# EAGLE design Display_02 (EAGLE 5.07)
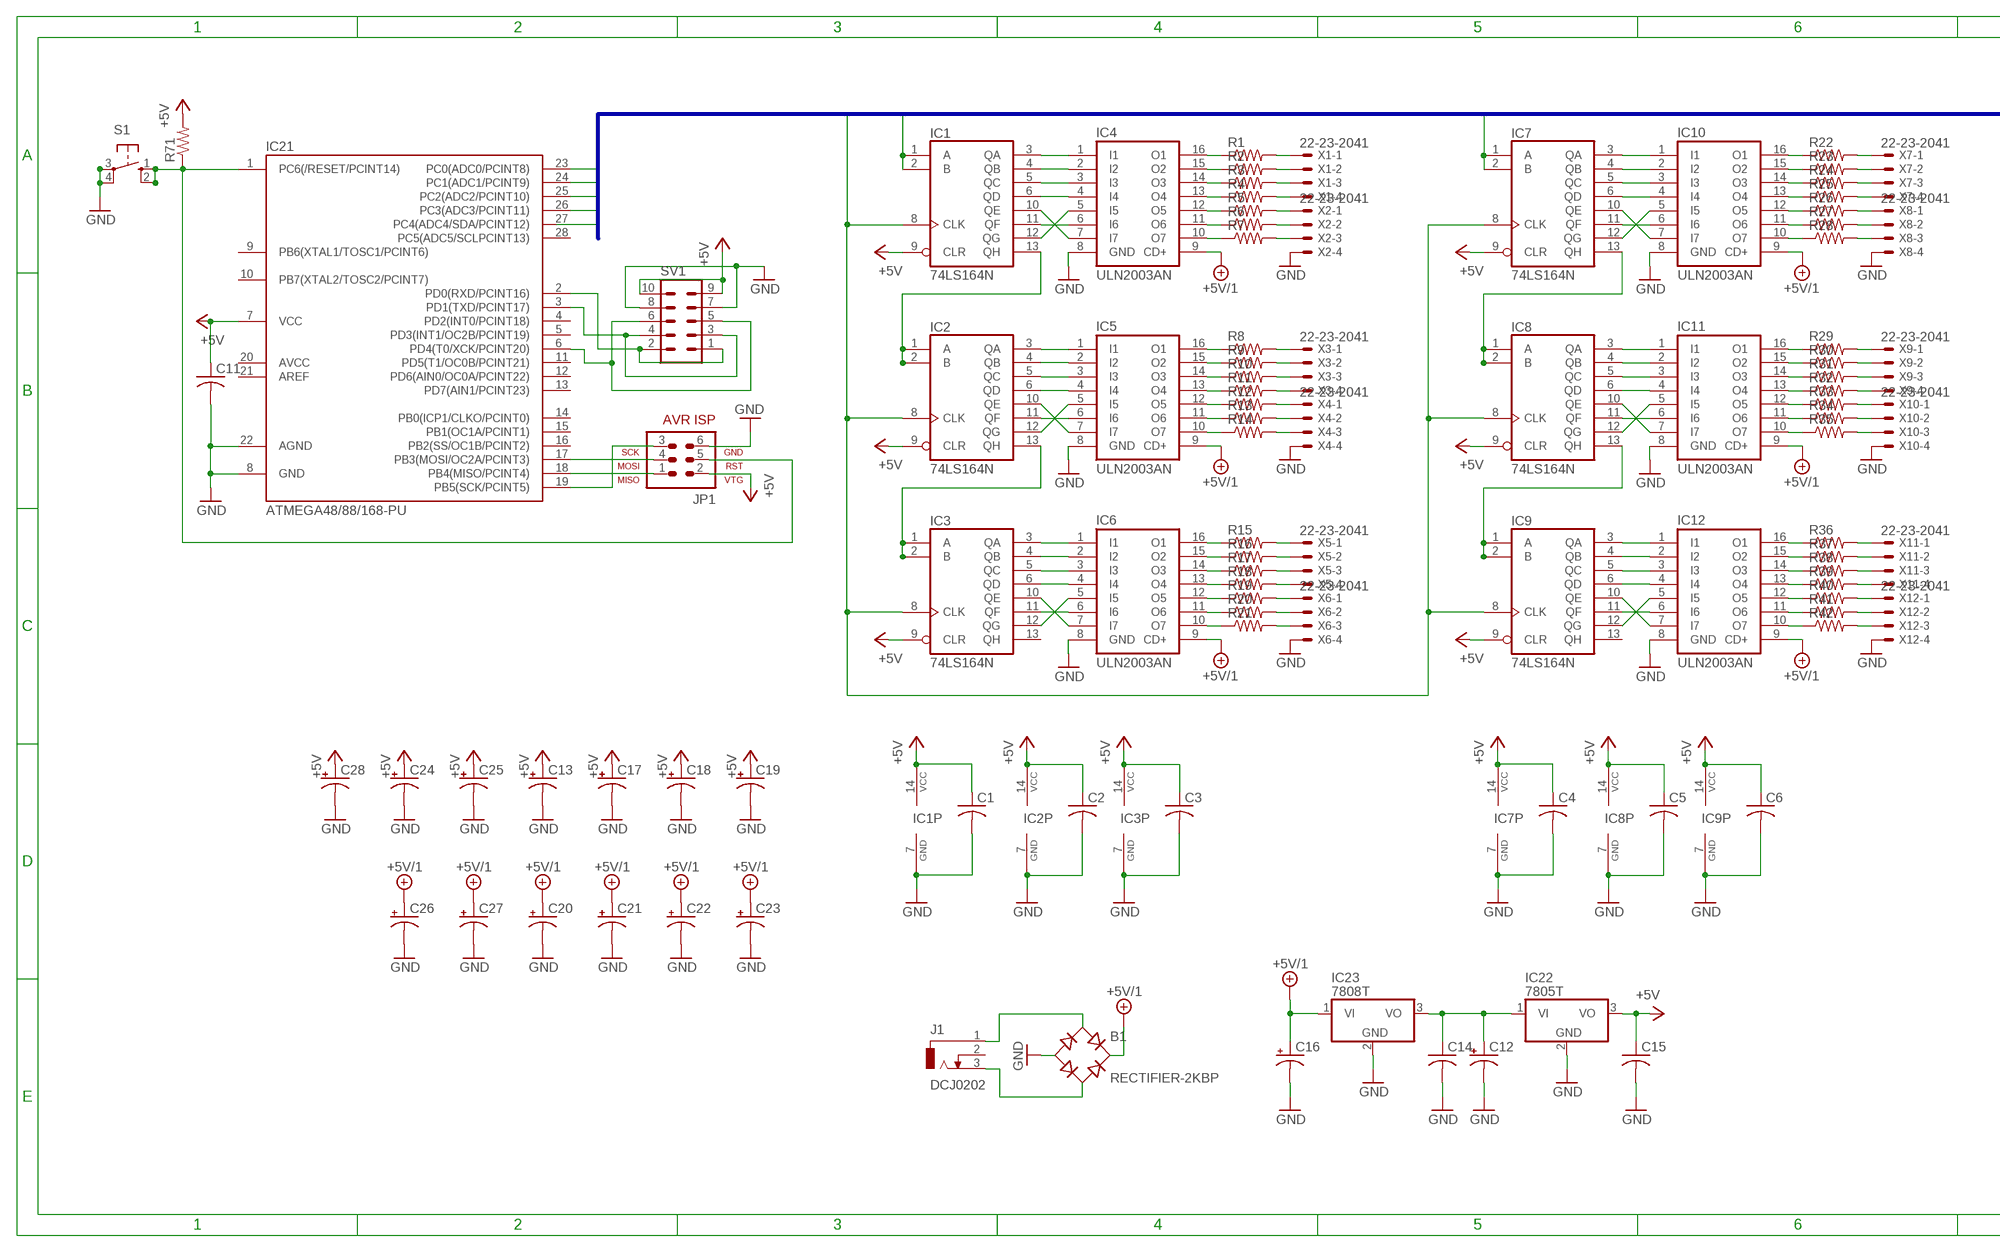
[diagram p0: schematic, sheet 1, part 1 of 2]
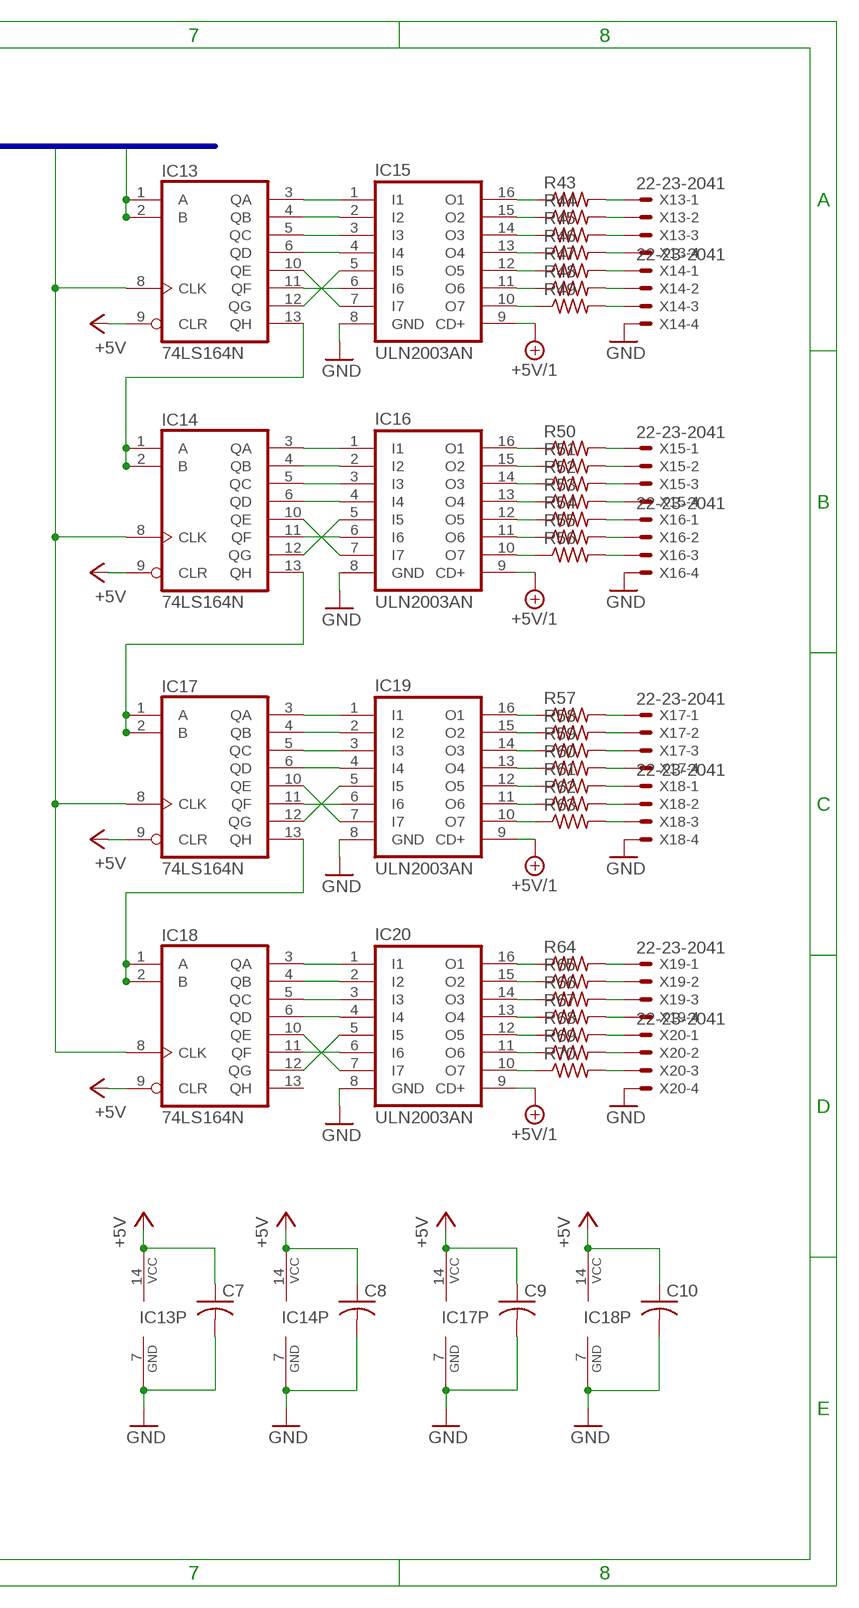
[diagram p1: schematic, sheet 1, part 2 of 2]

## Parts
B1  RECTIFIER-2KBP  [2KBP]
C1  C-US025-024X044  [C025-024X044]
C2  C-US025-024X044  [C025-024X044]
C3  C-US025-024X044  [C025-024X044]
C4  C-US025-024X044  [C025-024X044]
C5  C-US025-024X044  [C025-024X044]
C6  C-US025-024X044  [C025-024X044]
C7  C-US025-024X044  [C025-024X044]
C8  C-US025-024X044  [C025-024X044]
C9  C-US025-024X044  [C025-024X044]
C10  C-US025-024X044  [C025-024X044]
C11  C-US025-025X050  [C025-025X050]
C12  CPOL-USE2.5-7  [E2,5-7]
C13  CPOL-USE2.5-7  [E2,5-7]
C14  C-US025-030X050  [C025-030X050]
C15  C-US025-030X050  [C025-030X050]
C16  CPOL-USE2.5-7  [E2,5-7]
C17  CPOL-USE2.5-7  [E2,5-7]
C18  CPOL-USE2.5-7  [E2,5-7]
C19  CPOL-USE2.5-7  [E2,5-7]
C20  CPOL-USE2.5-7  [E2,5-7]
C21  CPOL-USE2.5-7  [E2,5-7]
C22  CPOL-USE2.5-7  [E2,5-7]
C23  CPOL-USE2.5-7  [E2,5-7]
C24  CPOL-USE2.5-7  [E2,5-7]
C25  CPOL-USE2.5-7  [E2,5-7]
C26  CPOL-USE2.5-7  [E2,5-7]
C27  CPOL-USE2.5-7  [E2,5-7]
C28  CPOL-USE2.5-7  [E2,5-7]
IC1  74LS164N  [DIL14]
IC2  74LS164N  [DIL14]
IC3  74LS164N  [DIL14]
IC4  ULN2003AN  [DIL16]
IC5  ULN2003AN  [DIL16]
IC6  ULN2003AN  [DIL16]
IC7  74LS164N  [DIL14]
IC8  74LS164N  [DIL14]
IC9  74LS164N  [DIL14]
IC10  ULN2003AN  [DIL16]
IC11  ULN2003AN  [DIL16]
IC12  ULN2003AN  [DIL16]
IC13  74LS164N  [DIL14]
IC14  74LS164N  [DIL14]
IC15  ULN2003AN  [DIL16]
IC16  ULN2003AN  [DIL16]
IC17  74LS164N  [DIL14]
IC18  74LS164N  [DIL14]
IC19  ULN2003AN  [DIL16]
IC20  ULN2003AN  [DIL16]
IC21  ATMEGA48/88/168-PU  [DIL28-3]
IC22  7805T  [TO220H]
IC23  7808T  [TO220H]
J1  DCJ0202  [DCJ0202]
JP1  AVR-ISP-6  [AVR-ISP-6]
R1  R-US_0204/7  [0204/7]
R2  R-US_0204/7  [0204/7]
R3  R-US_0204/7  [0204/7]
R4  R-US_0204/7  [0204/7]
R5  R-US_0204/7  [0204/7]
R6  R-US_0204/7  [0204/7]
R7  R-US_0204/7  [0204/7]
R8  R-US_0204/7  [0204/7]
R9  R-US_0204/7  [0204/7]
R10  R-US_0204/7  [0204/7]
R11  R-US_0204/7  [0204/7]
R12  R-US_0204/7  [0204/7]
R13  R-US_0204/7  [0204/7]
R14  R-US_0204/7  [0204/7]
R15  R-US_0204/7  [0204/7]
R16  R-US_0204/7  [0204/7]
R17  R-US_0204/7  [0204/7]
R18  R-US_0204/7  [0204/7]
R19  R-US_0204/7  [0204/7]
R20  R-US_0204/7  [0204/7]
R21  R-US_0204/7  [0204/7]
R22  R-US_0204/7  [0204/7]
R23  R-US_0204/7  [0204/7]
R24  R-US_0204/7  [0204/7]
R25  R-US_0204/7  [0204/7]
R26  R-US_0204/7  [0204/7]
R27  R-US_0204/7  [0204/7]
R28  R-US_0204/7  [0204/7]
R29  R-US_0204/7  [0204/7]
R30  R-US_0204/7  [0204/7]
R31  R-US_0204/7  [0204/7]
R32  R-US_0204/7  [0204/7]
R33  R-US_0204/7  [0204/7]
R34  R-US_0204/7  [0204/7]
R35  R-US_0204/7  [0204/7]
R36  R-US_0204/7  [0204/7]
R37  R-US_0204/7  [0204/7]
R38  R-US_0204/7  [0204/7]
R39  R-US_0204/7  [0204/7]
R40  R-US_0204/7  [0204/7]
R41  R-US_0204/7  [0204/7]
R42  R-US_0204/7  [0204/7]
R43  R-US_0204/7  [0204/7]
R44  R-US_0204/7  [0204/7]
R45  R-US_0204/7  [0204/7]
R46  R-US_0204/7  [0204/7]
R47  R-US_0204/7  [0204/7]
R48  R-US_0204/7  [0204/7]
R49  R-US_0204/7  [0204/7]
R50  R-US_0204/7  [0204/7]
R51  R-US_0204/7  [0204/7]
R52  R-US_0204/7  [0204/7]
R53  R-US_0204/7  [0204/7]
R54  R-US_0204/7  [0204/7]
R55  R-US_0204/7  [0204/7]
R56  R-US_0204/7  [0204/7]
R57  R-US_0204/7  [0204/7]
R58  R-US_0204/7  [0204/7]
R59  R-US_0204/7  [0204/7]
R60  R-US_0204/7  [0204/7]
R61  R-US_0204/7  [0204/7]
R62  R-US_0204/7  [0204/7]
R63  R-US_0204/7  [0204/7]
R64  R-US_0204/7  [0204/7]
R65  R-US_0204/7  [0204/7]
R66  R-US_0204/7  [0204/7]
R67  R-US_0204/7  [0204/7]
R68  R-US_0204/7  [0204/7]
R69  R-US_0204/7  [0204/7]
R70  R-US_0204/7  [0204/7]
R71  R-US_0204/7  [0204/7]
S1  10-XX  [B3F-10XX]
SV1  MA05-2  [MA05-2]
X1  22-23-2041  [22-23-2041]
X2  22-23-2041  [22-23-2041]
X3  22-23-2041  [22-23-2041]
X4  22-23-2041  [22-23-2041]
X5  22-23-2041  [22-23-2041]
X6  22-23-2041  [22-23-2041]
X7  22-23-2041  [22-23-2041]
X8  22-23-2041  [22-23-2041]
X9  22-23-2041  [22-23-2041]
X10  22-23-2041  [22-23-2041]
X11  22-23-2041  [22-23-2041]
X12  22-23-2041  [22-23-2041]
X13  22-23-2041  [22-23-2041]
X14  22-23-2041  [22-23-2041]
X15  22-23-2041  [22-23-2041]
X16  22-23-2041  [22-23-2041]
X17  22-23-2041  [22-23-2041]
X18  22-23-2041  [22-23-2041]
X19  22-23-2041  [22-23-2041]
X20  22-23-2041  [22-23-2041]

## Nets
+5V: C1.1 C2.1 C3.1 C4.1 C5.1 C6.1 C7.1 C8.1 C9.1 C10.1 C11.1 C13.+ C15.1 C17.+ C18.+ C19.+ C24.+ C25.+ C28.+ IC1.9(CLR) IC1.14(VCC) IC2.9(CLR) IC2.14(VCC) IC3.9(CLR) IC3.14(VCC) IC7.9(CLR) IC7.14(VCC) IC8.9(CLR) IC8.14(VCC) IC9.9(CLR) IC9.14(VCC) IC13.9(CLR) IC13.14(VCC) IC14.9(CLR) IC14.14(VCC) IC17.9(CLR) IC17.14(VCC) IC18.9(CLR) IC18.14(VCC) IC21.7(VCC) IC22.3(VO) JP1.2 R71.2 SV1.9 SV1.10
+5V/1: B1.+ C16.+ C20.+ C21.+ C22.+ C23.+ C26.+ C27.+ IC4.9(CD+) IC5.9(CD+) IC6.9(CD+) IC10.9(CD+) IC11.9(CD+) IC12.9(CD+) IC15.9(CD+) IC16.9(CD+) IC19.9(CD+) IC20.9(CD+) IC23.1(VI)
GND: B1.- C1.2 C2.2 C3.2 C4.2 C5.2 C6.2 C7.2 C8.2 C9.2 C10.2 C11.2 C12.- C13.- C14.2 C15.2 C16.- C17.- C18.- C19.- C20.- C21.- C22.- C23.- C24.- C25.- C26.- C27.- C28.- IC1.7(GND) IC2.7(GND) IC3.7(GND) IC4.8(GND) IC5.8(GND) IC6.8(GND) IC7.7(GND) IC8.7(GND) IC9.7(GND) IC10.8(GND) IC11.8(GND) IC12.8(GND) IC13.7(GND) IC14.7(GND) IC15.8(GND) IC16.8(GND) IC17.7(GND) IC18.7(GND) IC19.8(GND) IC20.8(GND) IC21.8(GND) IC21.22(AGND) IC22.2(GND) IC23.2(GND) JP1.6 S1.3(P) S1.4(P1) SV1.7 SV1.8 X2.4 X4.4 X6.4 X8.4 X10.4 X12.4 X14.4 X16.4 X18.4 X20.4
N$1: IC1.3(QA) IC4.1(I1)
N$2: IC1.4(QB) IC4.2(I2)
N$3: IC1.5(QC) IC4.3(I3)
N$4: IC1.6(QD) IC4.4(I4)
N$5: IC1.10(QE) IC4.7(I7)
N$6: IC1.11(QF) IC4.6(I6)
N$7: IC1.12(QG) IC4.5(I5)
N$8: IC2.3(QA) IC5.1(I1)
N$9: IC2.4(QB) IC5.2(I2)
N$10: IC2.5(QC) IC5.3(I3)
N$11: IC2.6(QD) IC5.4(I4)
N$12: IC2.10(QE) IC5.7(I7)
N$13: IC2.12(QG) IC5.5(I5)
N$14: IC2.11(QF) IC5.6(I6)
N$15: IC3.3(QA) IC6.1(I1)
N$16: IC3.4(QB) IC6.2(I2)
N$17: IC4.16(O1) R1.1
N$18: IC4.15(O2) R2.1
N$19: IC4.14(O3) R3.1
N$20: IC4.13(O4) R4.1
N$21: IC4.12(O5) R5.1
N$22: IC4.11(O6) R6.1
N$23: IC4.10(O7) R7.1
N$24: R1.2 X1.1
N$25: R2.2 X1.2
N$26: R3.2 X1.3
N$27: R4.2 X1.4
N$28: R5.2 X2.1
N$29: R6.2 X2.2
N$30: R7.2 X2.3
N$31: IC5.16(O1) R8.1
N$32: IC5.15(O2) R9.1
N$33: IC5.14(O3) R10.1
N$34: IC5.13(O4) R11.1
N$35: IC5.12(O5) R12.1
N$36: IC5.11(O6) R13.1
N$37: IC5.10(O7) R14.1
N$38: R8.2 X3.1
N$39: R9.2 X3.2
N$40: R10.2 X3.3
N$41: R11.2 X3.4
N$42: R12.2 X4.1
N$43: R13.2 X4.2
N$44: R14.2 X4.3
N$45: IC6.16(O1) R15.1
N$46: IC6.15(O2) R16.1
N$47: IC6.14(O3) R17.1
N$48: IC6.13(O4) R18.1
N$49: IC6.12(O5) R19.1
N$50: IC6.11(O6) R20.1
N$51: IC6.10(O7) R21.1
N$52: R15.2 X5.1
N$53: R16.2 X5.2
N$54: R17.2 X5.3
N$55: R18.2 X5.4
N$56: R19.2 X6.1
N$57: R20.2 X6.2
N$58: R21.2 X6.3
N$59: IC21.2(PD0(RXD/PCINT16)) SV1.1 SV1.2
N$60: IC21.3(PD1(TXD/PCINT17)) SV1.3 SV1.4
N$61: IC3.5(QC) IC6.3(I3)
N$62: IC3.6(QD) IC6.4(I4)
N$63: IC3.10(QE) IC6.7(I7)
N$64: IC3.12(QG) IC6.5(I5)
N$65: IC3.11(QF) IC6.6(I6)
N$66: IC10.16(O1) R22.1
N$67: IC2.13(QH) IC3.1(A) IC3.2(B)
N$68: IC1.13(QH) IC2.1(A) IC2.2(B)
N$69: IC10.15(O2) R23.1
N$70: IC10.14(O3) R24.1
N$71: IC10.13(O4) R25.1
N$72: IC10.12(O5) R26.1
N$73: IC10.11(O6) R27.1
N$74: IC10.10(O7) R28.1
N$75: R22.2 X7.1
N$76: R23.2 X7.2
N$77: R24.2 X7.3
N$78: R25.2 X7.4
N$79: R26.2 X8.1
N$80: R27.2 X8.2
N$81: R28.2 X8.3
N$82: IC11.16(O1) R29.1
N$83: IC11.15(O2) R30.1
N$84: IC11.14(O3) R31.1
N$85: IC11.13(O4) R32.1
N$86: IC11.12(O5) R33.1
N$87: IC11.11(O6) R34.1
N$88: IC11.10(O7) R35.1
N$89: R29.2 X9.1
N$90: R30.2 X9.2
N$91: R31.2 X9.3
N$92: R32.2 X9.4
N$93: R33.2 X10.1
N$94: R34.2 X10.2
N$95: R35.2 X10.3
N$96: IC12.16(O1) R36.1
N$97: IC12.15(O2) R37.1
N$98: IC12.14(O3) R38.1
N$99: IC12.13(O4) R39.1
N$100: IC12.12(O5) R40.1
N$101: IC12.11(O6) R41.1
N$102: IC12.10(O7) R42.1
N$103: R36.2 X11.1
N$104: R37.2 X11.2
N$105: R38.2 X11.3
N$106: R39.2 X11.4
N$107: R40.2 X12.1
N$108: R41.2 X12.2
N$109: R42.2 X12.3
N$110: IC8.13(QH) IC9.1(A) IC9.2(B)
N$111: IC7.13(QH) IC8.1(A) IC8.2(B)
N$112: IC15.16(O1) R43.1
N$113: IC21.6(PD4(T0/XCK/PCINT20)) SV1.5 SV1.6
N$114: IC7.6(QD) IC10.4(I4)
N$115: IC7.5(QC) IC10.3(I3)
N$116: IC7.4(QB) IC10.2(I2)
N$117: IC7.3(QA) IC10.1(I1)
N$118: IC7.10(QE) IC10.7(I7)
N$119: IC7.11(QF) IC10.6(I6)
N$120: IC7.12(QG) IC10.5(I5)
N$121: IC8.3(QA) IC11.1(I1)
N$122: IC8.4(QB) IC11.2(I2)
N$123: IC8.5(QC) IC11.3(I3)
N$124: IC8.6(QD) IC11.4(I4)
N$125: IC8.10(QE) IC11.7(I7)
N$126: IC8.12(QG) IC11.5(I5)
N$127: IC8.11(QF) IC11.6(I6)
N$128: IC9.3(QA) IC12.1(I1)
N$129: IC9.4(QB) IC12.2(I2)
N$130: IC9.5(QC) IC12.3(I3)
N$131: IC9.6(QD) IC12.4(I4)
N$132: IC9.10(QE) IC12.7(I7)
N$133: IC9.12(QG) IC12.5(I5)
N$134: IC9.11(QF) IC12.6(I6)
N$135: IC15.15(O2) R44.1
N$136: IC15.14(O3) R45.1
N$137: IC15.13(O4) R46.1
N$138: IC15.12(O5) R47.1
N$139: IC15.11(O6) R48.1
N$140: IC15.10(O7) R49.1
N$141: R43.2 X13.1
N$142: R44.2 X13.2
N$143: R45.2 X13.3
N$144: R46.2 X13.4
N$145: R47.2 X14.1
N$146: R48.2 X14.2
N$147: R49.2 X14.3
N$148: IC16.16(O1) R50.1
N$149: IC16.15(O2) R51.1
N$150: IC16.14(O3) R52.1
N$151: IC16.13(O4) R53.1
N$152: IC16.12(O5) R54.1
N$153: IC16.11(O6) R55.1
N$154: IC16.10(O7) R56.1
N$155: R50.2 X15.1
N$156: R51.2 X15.2
N$157: R52.2 X15.3
N$158: R53.2 X15.4
N$159: R54.2 X16.1
N$160: R55.2 X16.2
N$161: R56.2 X16.3
N$162: IC13.13(QH) IC14.1(A) IC14.2(B)
N$165: IC13.10(QE) IC15.7(I7)
N$166: IC13.12(QG) IC15.5(I5)
N$167: IC13.11(QF) IC15.6(I6)
N$168: IC14.10(QE) IC16.7(I7)
N$169: IC14.12(QG) IC16.5(I5)
N$170: IC14.11(QF) IC16.6(I6)
N$171: IC13.3(QA) IC15.1(I1)
N$172: IC13.4(QB) IC15.2(I2)
N$173: IC13.5(QC) IC15.3(I3)
N$174: IC13.6(QD) IC15.4(I4)
N$175: IC14.3(QA) IC16.1(I1)
N$176: IC14.4(QB) IC16.2(I2)
N$177: IC14.5(QC) IC16.3(I3)
N$178: IC14.6(QD) IC16.4(I4)
N$179: IC19.16(O1) R57.1
N$180: IC19.15(O2) R58.1
N$181: IC19.14(O3) R59.1
N$182: IC19.13(O4) R60.1
N$183: IC19.12(O5) R61.1
N$184: IC19.11(O6) R62.1
N$185: IC19.10(O7) R63.1
N$186: R57.2 X17.1
N$187: R58.2 X17.2
N$188: R59.2 X17.3
N$189: R60.2 X17.4
N$190: R61.2 X18.1
N$191: R62.2 X18.2
N$192: R63.2 X18.3
N$193: IC20.16(O1) R64.1
N$194: IC20.15(O2) R65.1
N$195: IC20.14(O3) R66.1
N$196: IC20.13(O4) R67.1
N$197: IC20.12(O5) R68.1
N$198: IC20.11(O6) R69.1
N$199: IC20.10(O7) R70.1
N$200: R64.2 X19.1
N$201: R65.2 X19.2
N$202: R66.2 X19.3
N$203: R67.2 X19.4
N$204: R68.2 X20.1
N$205: R69.2 X20.2
N$206: R70.2 X20.3
N$207: IC17.13(QH) IC18.1(A) IC18.2(B)
N$208: IC14.13(QH) IC17.1(A) IC17.2(B)
N$209: IC21.18(PB4(MISO/PCINT4)) JP1.1
N$210: IC17.10(QE) IC19.7(I7)
N$211: IC17.12(QG) IC19.5(I5)
N$212: IC17.11(QF) IC19.6(I6)
N$213: IC18.10(QE) IC20.7(I7)
N$214: IC18.12(QG) IC20.5(I5)
N$215: IC18.11(QF) IC20.6(I6)
N$216: IC17.3(QA) IC19.1(I1)
N$217: IC17.4(QB) IC19.2(I2)
N$218: IC17.5(QC) IC19.3(I3)
N$219: IC17.6(QD) IC19.4(I4)
N$220: IC18.3(QA) IC20.1(I1)
N$221: IC18.4(QB) IC20.2(I2)
N$222: IC18.5(QC) IC20.3(I3)
N$223: IC18.6(QD) IC20.4(I4)
N$224: IC21.17(PB3(MOSI/OC2A/PCINT3)) JP1.4
N$225: IC21.19(PB5(SCK/PCINT5)) JP1.3
N$226: IC21.1(PC6(/RESET/PCINT14)) JP1.5 R71.1 S1.1(S) S1.2(S1)
N$227: C12.+ C14.1 IC22.1(VI) IC23.3(VO)
N$228: B1.AC2 J1.3
N$229: B1.AC1 J1.1
PORTC0: IC13.1(A) IC13.2(B) IC21.23(PC0(ADC0/PCINT8))
PORTC1: IC13.8(CLK) IC14.8(CLK) IC17.8(CLK) IC18.8(CLK) IC21.24(PC1(ADC1/PCINT9))
PORTC2: IC7.1(A) IC7.2(B) IC21.25(PC2(ADC2/PCINT10))
PORTC3: IC1.1(A) IC1.2(B) IC21.26(PC3(ADC3/PCINT11))
PORTC4: IC1.8(CLK) IC2.8(CLK) IC3.8(CLK) IC7.8(CLK) IC8.8(CLK) IC9.8(CLK)
Unconnected: IC3.13(QH) IC9.13(QH) IC18.13(QH) IC21.4(PD2(INT0/PCINT18)) IC21.5(PD3(INT1/OC2B/PCINT19)) IC21.9(PB6(XTAL1/TOSC1/PCINT6)) IC21.10(PB7(XTAL2/TOSC2/PCINT7)) IC21.11(PD5(T1/OC0B/PCINT21)) IC21.12(PD6(AIN0/OC0A/PCINT22)) IC21.13(PD7(AIN1/PCINT23)) IC21.14(PB0(ICP1/CLKO/PCINT0)) IC21.15(PB1(OC1A/PCINT1)) IC21.16(PB2(SS/OC1B/PCINT2)) IC21.20(AVCC) IC21.21(AREF) IC21.27(PC4(ADC4/SDA/PCINT12)) IC21.28(PC5(ADC5/SCLPCINT13)) J1.2

## Buses
PORTC[0..5]

## Library data of the parts
B1 = rectifier:RECTIFIER-: Rectifier
C1-C10 C14 C15 = rcl:C-US: CAPACITOR, American symbol
C11 = resistor:C-US: CAPACITOR, American symbol
C12 C13 C16-C28 = rcl:CPOL-US: POLARIZED CAPACITOR, American symbol
IC1-IC3 IC7-IC9 IC13 IC14 IC17 IC18 = 74xx-us:74*164: 8-bit parallel out SHIFT REGISTER
IC4-IC6 IC10-IC12 IC15 IC16 IC19 IC20 = uln-udn:ULN2003A: DRIVER ARRAY
IC21 = atmega8:ATMEGA48/88/168-PU
IC22 IC23 = linear:78*: Positive VOLTAGE REGULATOR Source: http://cache.national.com/ds/LM/LM78L05.pdf http://www.fairchildsemi.com/ds/LM/LM7805.pdf
J1 = con-jack:DCJ0202: DC POWER JACK Source: DCJ0202.pdf
JP1 = avr-6:AVR-ISP-6: AVR ISP-6 Serial Programming Header
R1-R71 = rcl:R-US_: RESISTOR, American symbol
S1 = switch-omron:10-XX: OMRON SWITCH
SV1 = con-lstb:MA05-2: PIN HEADER
X1-X20 = con-molex:22-23-2041: .100" (2.54mm) Center Header - 4 Pin

## Board
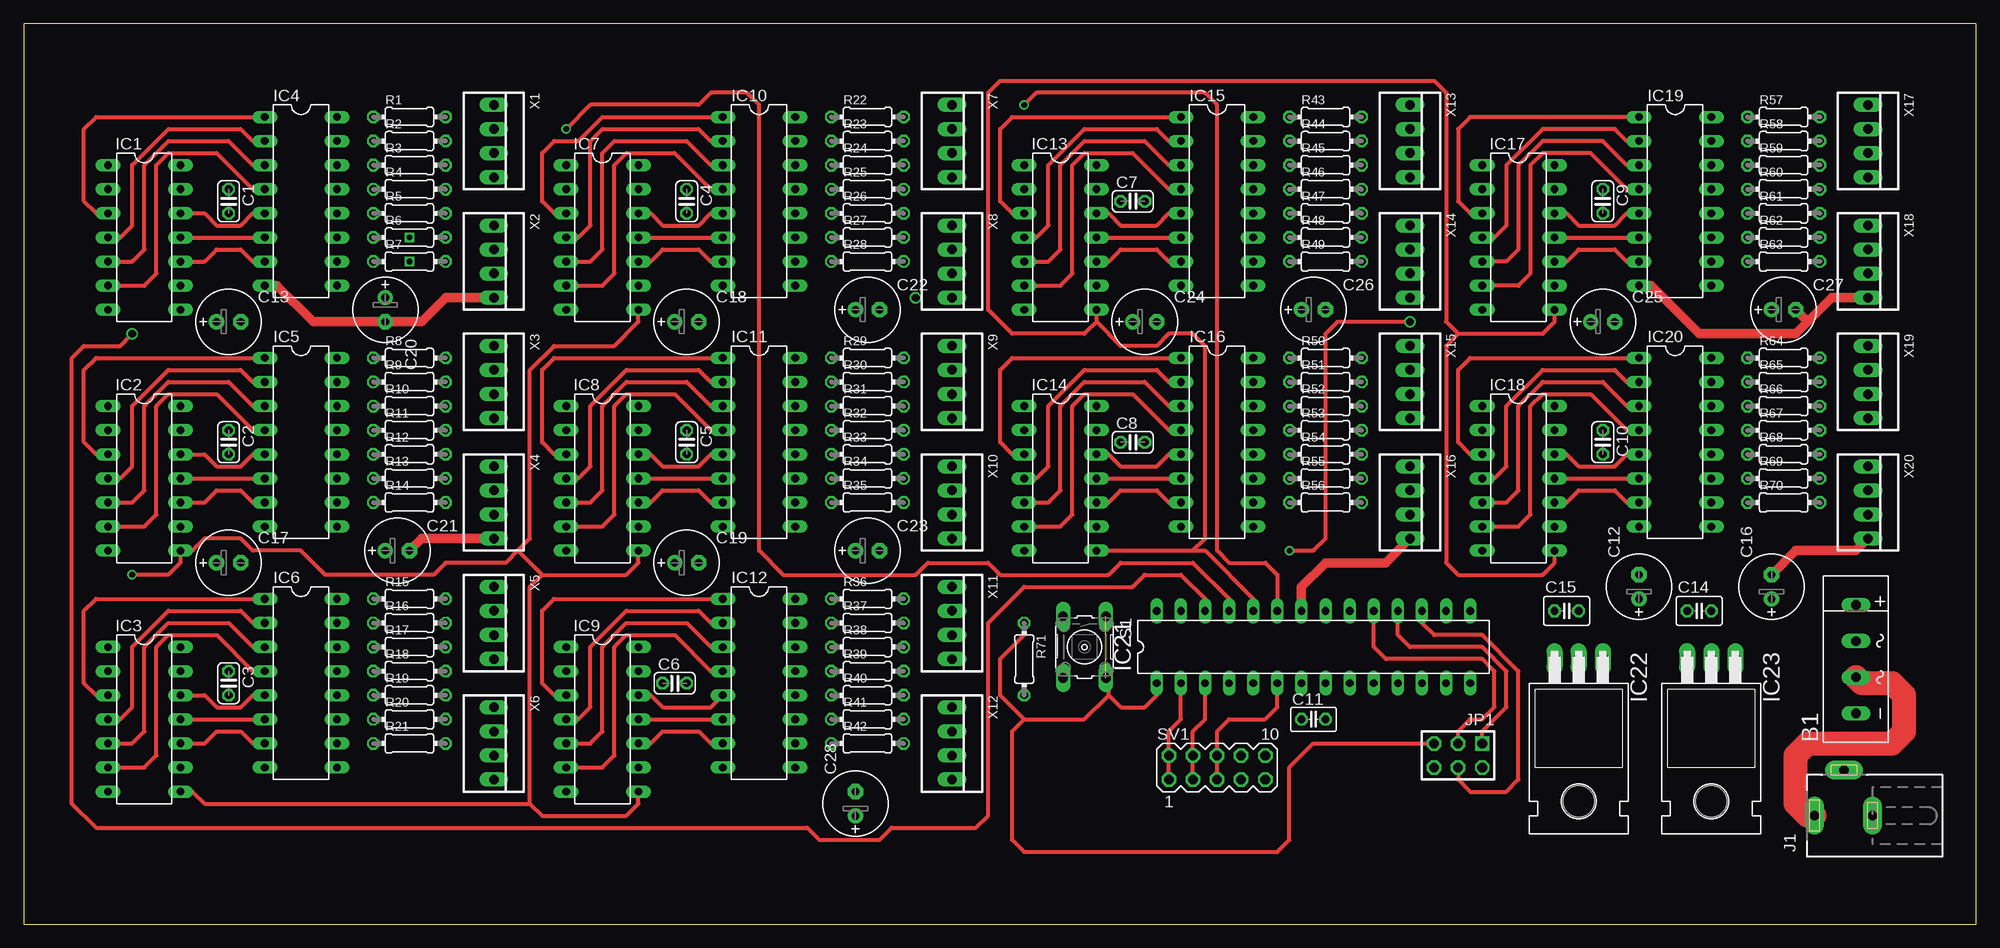
[diagram p2: board, top side]
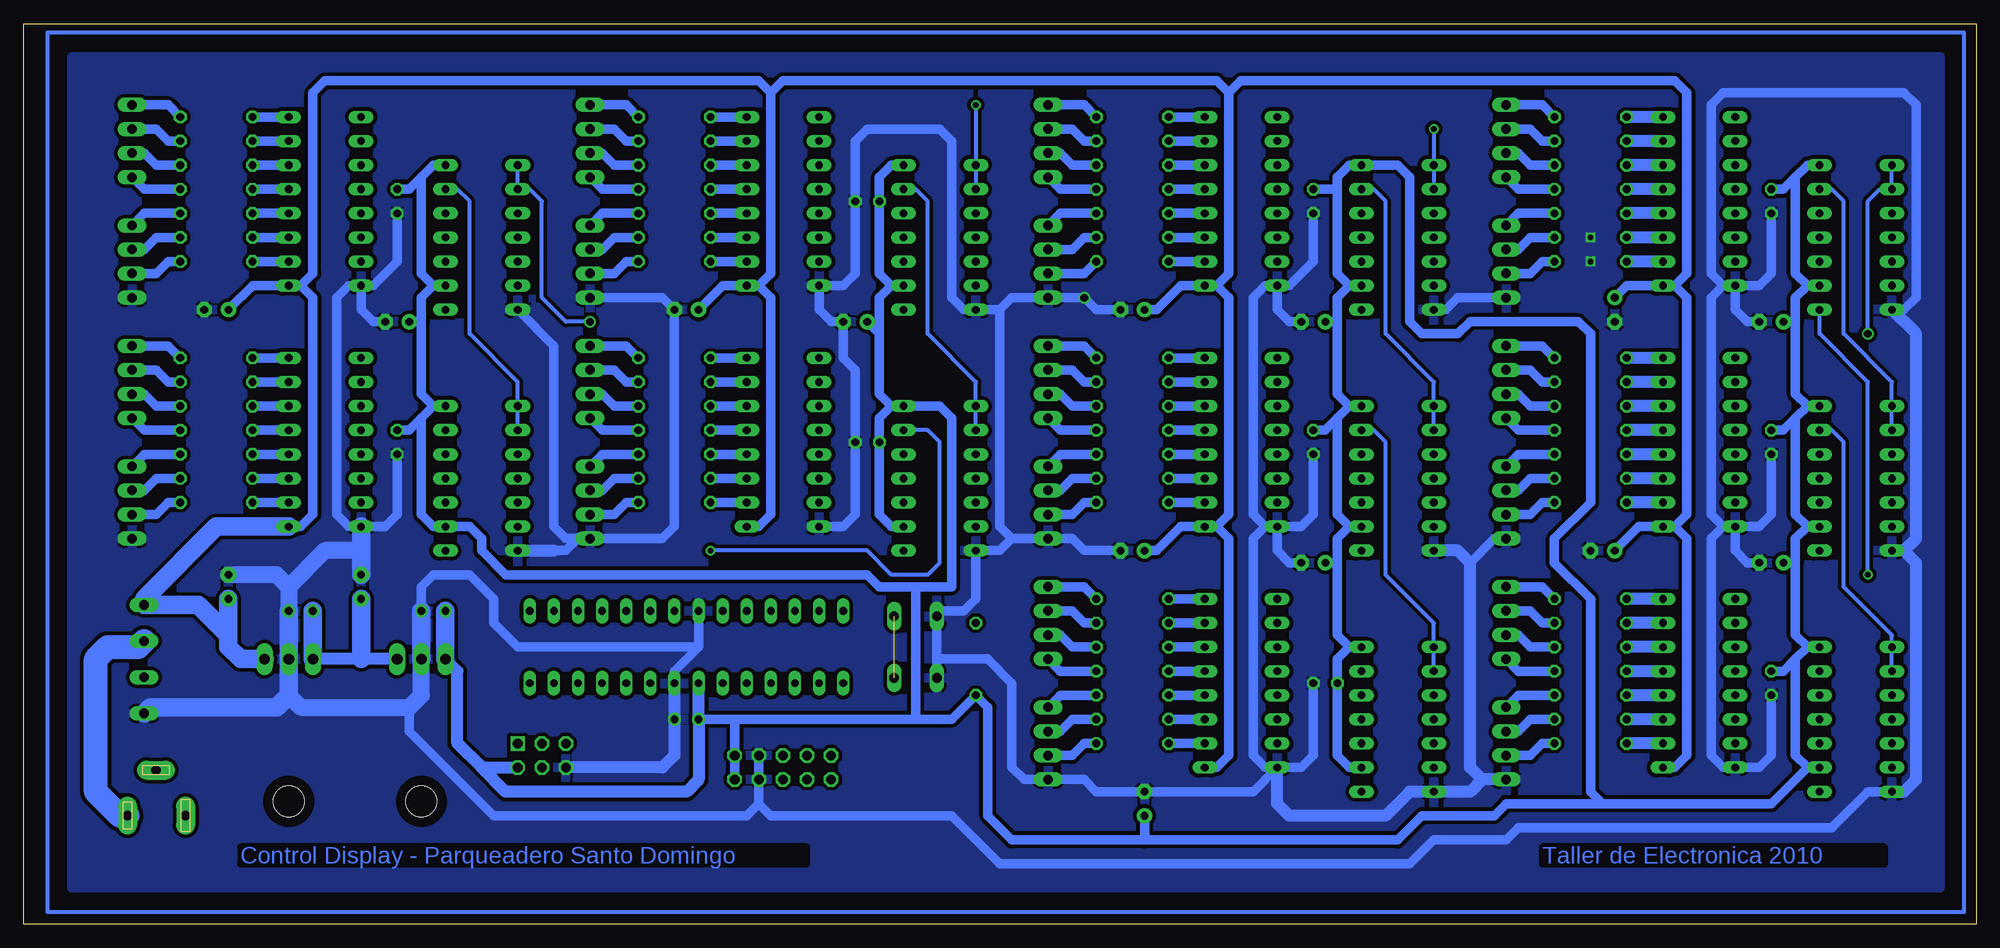
[diagram p3: board, bottom side, seen from below]

Size 205.72 x 94.92 mm. Coordinates in mm from the lower left corner, seen from the top.
Outline: 0,0 205.72,0 205.72,94.92 0,94.92 0,0
Copper layers (1*16): Top 0.035mm / dielectric 1.5mm / Bottom 0.035mm
Design rules "default *": minimum track width 15mil, minimum drill 24mil, track to track 15mil, track to pad 15mil, pad to pad 15mil, via to via 15mil, smd to smd 8mil, copper to edge 40mil, drill to drill 8mil, minimum pad ring 10mil, minimum via ring 8mil, stop-mask expansion 4mil, vias tented up to drill 0mil, thermal gap 10mil

### Footprints (pad centres in the part's own frame; a part is rotated, then mirrored left to right if it is on the bottom)
2KBP = drill 1.016 long: + 5.715,0; - -5.715,0; AC1 -1.905,0; AC2 1.905,0
C025-024X044 = drill 0.813 octagon: 1 -1.27,0; 2 1.27,0
C025-025X050 = drill 0.813 octagon: 1 -1.27,0; 2 1.27,0
E2,5-7 = drill 0.813 pad 1.6 round: + -1.27,0 | drill 0.813 pad 1.6 octagon: - 1.27,0
C025-030X050 = drill 0.813 octagon: 1 -1.27,0; 2 1.27,0
DIL14 = drill 0.813 long: 1 -7.62,-3.81; 2 -5.08,-3.81; 3 -2.54,-3.81; 4 0,-3.81; 5 2.54,-3.81; 6 5.08,-3.81; 7 7.62,-3.81; 8 7.62,3.81; 9 5.08,3.81; 10 2.54,3.81; 11 0,3.81; 12 -2.54,3.81; 13 -5.08,3.81; 14 -7.62,3.81
DIL16 = drill 0.813 long: 1 -8.89,-3.81; 2 -6.35,-3.81; 3 -3.81,-3.81; 4 -1.27,-3.81; 5 1.27,-3.81; 6 3.81,-3.81; 7 6.35,-3.81; 8 8.89,-3.81; 9 8.89,3.81; 10 6.35,3.81; 11 3.81,3.81; 12 1.27,3.81; 13 -1.27,3.81; 14 -3.81,3.81; 15 -6.35,3.81; 16 -8.89,3.81
DIL28-3 = drill 0.813 long: 1 -16.51,-3.81; 2 -13.97,-3.81; 3 -11.43,-3.81; 4 -8.89,-3.81; 5 -6.35,-3.81; 6 -3.81,-3.81; 7 -1.27,-3.81; 8 1.27,-3.81; 9 3.81,-3.81; 10 6.35,-3.81; 11 8.89,-3.81; 12 11.43,-3.81; 13 13.97,-3.81; 14 16.51,-3.81; 15 16.51,3.81; 16 13.97,3.81; 17 11.43,3.81; 18 8.89,3.81; 19 6.35,3.81; 20 3.81,3.81; 21 1.27,3.81; 22 -1.27,3.81; 23 -3.81,3.81; 24 -6.35,3.81; 25 -8.89,3.81; 26 -11.43,3.81; 27 -13.97,3.81; 28 -16.51,3.81
TO220H = drill 1.118 long: 1 -2.54,-10.16; 2 0,-10.16; 3 2.54,-10.16 | hole 3.302: 0,4.826
DCJ0202 = drill 1 pad 2 long: 1 0,3.1; 2 4.8,0; 3 0,-3
AVR-ISP-6 = drill 1.016 square: 1 -2.54,-1.27 | drill 1.016 octagon: 2 -2.54,1.27; 3 0,-1.27; 4 0,1.27; 5 2.54,-1.27; 6 2.54,1.27
0204/7 = drill 0.813 octagon: 1 -3.81,0; 2 3.81,0
B3F-10XX = drill 1.016 long: 1 -3.251,2.261; 2 3.251,2.261; 3 -3.251,-2.261; 4 3.251,-2.261
MA05-2 = drill 1.016 octagon: 1 -5.08,-1.27; 2 -5.08,1.27; 3 -2.54,-1.27; 4 -2.54,1.27; 5 0,-1.27; 6 0,1.27; 7 2.54,-1.27; 8 2.54,1.27; 9 5.08,-1.27; 10 5.08,1.27
22-23-2041 = drill 1 long: 1 -3.81,0; 2 -1.27,0; 3 1.27,0; 4 3.81,0

### Placement (x,y rotation side)
B1  193.04,27.94 90 top
C1  21.59,76.2 270 top
C2  21.59,50.8 270 top
C3  21.59,25.4 270 top
C4  69.85,76.2 270 top
C5  69.85,50.8 270 top
C6  68.58,25.4 0 top
C7  116.84,76.2 0 top
C8  116.84,50.8 0 top
C9  166.37,76.2 270 top
C10  166.37,50.8 270 top
C11  135.89,21.59 0 top
C12  170.18,35.56 90 top
C13  21.59,63.5 0 top
C14  176.53,33.02 0 top
C15  162.56,33.02 0 top
C16  184.15,35.56 90 top
C17  21.59,38.1 0 top
C18  69.85,63.5 0 top
C19  69.85,38.1 0 top
C20  38.1,64.77 270 top
C21  39.37,39.37 0 top
C22  88.9,64.77 0 top
C23  88.9,39.37 0 top
C24  118.11,63.5 0 top
C25  166.37,63.5 0 top
C26  135.89,64.77 0 top
C27  185.42,64.77 0 top
C28  87.63,12.7 90 top
IC1  12.7,72.39 270 top
IC2  12.7,46.99 270 top
IC3  12.7,21.59 270 top
IC4  29.21,76.2 270 top
IC5  29.21,50.8 270 top
IC6  29.21,25.4 270 top
IC7  60.96,72.39 270 top
IC8  60.96,46.99 270 top
IC9  60.96,21.59 270 top
IC10  77.47,76.2 270 top
IC11  77.47,50.8 270 top
IC12  77.47,25.4 270 top
IC13  109.22,72.39 270 top
IC14  109.22,46.99 270 top
IC15  125.73,76.2 270 top
IC16  125.73,50.8 270 top
IC17  157.48,72.39 270 top
IC18  157.48,46.99 270 top
IC19  173.99,76.2 270 top
IC20  173.99,50.8 270 top
IC21  135.89,29.21 0 top
IC22  163.83,17.78 180 top
IC23  177.8,17.78 180 top
J1  191.77,11.43 90 top
JP1  151.13,17.78 180 top
R1  40.64,85.09 0 top
R2  40.64,82.55 0 top
R3  40.64,80.01 0 top
R4  40.64,77.47 0 top
R5  40.64,74.93 0 top
R6  40.64,72.39 0 top
R7  40.64,69.85 0 top
R8  40.64,59.69 0 top
R9  40.64,57.15 0 top
R10  40.64,54.61 0 top
R11  40.64,52.07 0 top
R12  40.64,49.53 0 top
R13  40.64,46.99 0 top
R14  40.64,44.45 0 top
R15  40.64,34.29 0 top
R16  40.64,31.75 0 top
R17  40.64,29.21 0 top
R18  40.64,26.67 0 top
R19  40.64,24.13 0 top
R20  40.64,21.59 0 top
R21  40.64,19.05 0 top
R22  88.9,85.09 0 top
R23  88.9,82.55 0 top
R24  88.9,80.01 0 top
R25  88.9,77.47 0 top
R26  88.9,74.93 0 top
R27  88.9,72.39 0 top
R28  88.9,69.85 0 top
R29  88.9,59.69 0 top
R30  88.9,57.15 0 top
R31  88.9,54.61 0 top
R32  88.9,52.07 0 top
R33  88.9,49.53 0 top
R34  88.9,46.99 0 top
R35  88.9,44.45 0 top
R36  88.9,34.29 0 top
R37  88.9,31.75 0 top
R38  88.9,29.21 0 top
R39  88.9,26.67 0 top
R40  88.9,24.13 0 top
R41  88.9,21.59 0 top
R42  88.9,19.05 0 top
R43  137.16,85.09 0 top
R44  137.16,82.55 0 top
R45  137.16,80.01 0 top
R46  137.16,77.47 0 top
R47  137.16,74.93 0 top
R48  137.16,72.39 0 top
R49  137.16,69.85 0 top
R50  137.16,59.69 0 top
R51  137.16,57.15 0 top
R52  137.16,54.61 0 top
R53  137.16,52.07 0 top
R54  137.16,49.53 0 top
R55  137.16,46.99 0 top
R56  137.16,44.45 0 top
R57  185.42,85.09 0 top
R58  185.42,82.55 0 top
R59  185.42,80.01 0 top
R60  185.42,77.47 0 top
R61  185.42,74.93 0 top
R62  185.42,72.39 0 top
R63  185.42,69.85 0 top
R64  185.42,59.69 0 top
R65  185.42,57.15 0 top
R66  185.42,54.61 0 top
R67  185.42,52.07 0 top
R68  185.42,49.53 0 top
R69  185.42,46.99 0 top
R70  185.42,44.45 0 top
R71  105.41,27.94 270 top
S1  111.76,29.21 270 top
SV1  125.73,16.51 0 top
X1  49.53,82.55 270 top
X2  49.53,69.85 270 top
X3  49.53,57.15 270 top
X4  49.53,44.45 270 top
X5  49.53,31.75 270 top
X6  49.53,19.05 270 top
X7  97.79,82.55 270 top
X8  97.79,69.85 270 top
X9  97.79,57.15 270 top
X10  97.79,44.45 270 top
X11  97.79,31.75 270 top
X12  97.79,19.05 270 top
X13  146.05,82.55 270 top
X14  146.05,69.85 270 top
X15  146.05,57.15 270 top
X16  146.05,44.45 270 top
X17  194.31,82.55 270 top
X18  194.31,69.85 270 top
X19  194.31,57.15 270 top
X20  194.31,44.45 270 top

### Tracks (layer width: path | path; a pad name or v marks a point on that pad's centre or on a via)
+5V
  Bottom 1.016: IC13.14 114.3,80.01 115.57,78.74 C7.1 115.57,68.58 114.3,67.31 | 114.3,67.31 IC13.9 | 114.3,67.31 115.57,66.04 115.57,62.23 | 115.57,62.23 115.57,55.88 114.3,54.61 | 162.56,67.31 163.83,68.58 163.83,78.74 | 163.83,78.74 162.56,80.01 IC17.14 | 162.56,67.31 IC17.9 | 162.56,67.31 163.83,66.04 163.83,63.5 | 163.83,63.5 163.83,55.88 162.56,54.61 | 162.56,54.61 IC18.14 | 163.83,53.34 162.56,54.61 | 163.83,53.34 163.83,43.18 162.56,41.91 IC18.9 158.75,41.91 157.48,40.64 157.48,39.37 154.94,36.83 116.84,36.83 115.57,35.56 111.76,35.56 | C10.1 165.1,52.07 163.83,53.34 | IC1.14 17.78,80.01 19.05,78.74 | 19.05,78.74 19.05,68.58 17.78,67.31 | 17.78,67.31 IC1.9 | 17.78,67.31 19.05,66.04 19.05,63.5 | 19.05,63.5 19.05,55.88 17.78,54.61 | 17.78,54.61 IC2.14 | 17.78,41.91 19.05,43.18 19.05,53.34 | 19.05,53.34 17.78,54.61 | IC3.9 17.78,16.51 | 17.78,16.51 19.05,17.78 19.05,27.94 | 19.05,27.94 17.78,29.21 | 17.78,29.21 IC3.14 | 66.04,29.21 IC9.14 | 66.04,41.91 IC8.9 | 66.04,54.61 67.31,53.34 | 66.04,54.61 IC8.14 | 66.04,54.61 67.31,55.88 67.31,63.5 | 67.31,63.5 67.31,66.04 66.04,67.31 | 66.04,67.31 IC7.9 | 66.04,67.31 67.31,68.58 67.31,77.47 | 67.31,77.47 67.31,78.74 66.04,80.01 IC7.14 60.96,80.01 59.69,78.74 59.69,63.5 58.42,62.23 54.61,62.23 53.34,63.5 41.91,63.5 40.64,62.23 40.64,44.45 44.45,40.64 44.45,38.1 40.64,34.29 40.64,13.97 39.37,12.7 | 67.31,77.47 C4.1 | C3.1 20.32,26.67 19.05,27.94 | C2.1 20.32,52.07 19.05,53.34 | C1.1 20.32,77.47 19.05,78.74 | C9.1 165.1,77.47 163.83,78.74 | 17.78,41.91 IC2.9 | 17.78,41.91 19.05,40.64 19.05,38.1 | 19.05,38.1 19.05,30.48 17.78,29.21 | IC14.9 114.3,41.91 115.57,43.18 C8.1 115.57,53.34 114.3,54.61
  Bottom 1.016: 114.3,54.61 IC14.14 109.22,54.61 107.95,53.34 107.95,35.56 111.76,35.56 | 39.37,12.7 21.59,12.7 17.78,16.51 | C5.1 68.58,52.07 67.31,53.34 | 67.31,53.34 67.31,43.18 66.04,41.91 | 66.04,41.91 67.31,40.64 67.31,38.1 | 67.31,38.1 67.31,30.48 66.04,29.21 | 66.04,29.21 67.31,27.94 C6.1 67.31,17.78 66.04,16.51 IC9.9 | 87.63,8.89 60.96,8.89 58.42,11.43 50.8,11.43 49.53,12.7 39.37,12.7 | 87.63,8.89 101.6,8.89 104.14,11.43 104.14,22.86 R71.2 107.95,21.59 111.76,21.59 | 19.05,38.1 C17.+ | 19.05,63.5 C13.+ | 67.31,63.5 C18.+ | 67.31,38.1 C19.+ | 115.57,62.23 C24.+ | 163.83,63.5 C25.+ | 111.76,21.59 130.81,21.59 | 130.81,21.59 C11.1 | 87.63,8.89 C28.+ | SV1.10 SV1.9 130.81,21.59 | 111.76,21.59 111.76,35.56
  Bottom 1.27: 157.48,16.51 160.02,19.05 160.02,26.67 IC22.3 | IC21.7 C11.1 134.62,15.24 135.89,13.97 154.94,13.97 157.48,16.51 | 157.48,16.51 JP1.2
  Bottom 1.93: IC22.3 C15.1
+5V/1
  Bottom 1.016: 80.01,67.31 IC10.9 83.82,67.31 86.36,64.77 C22.+ | 128.27,67.31 127,66.04 127,43.18 128.27,41.91 IC16.9 | 176.53,67.31 IC19.9 181.61,67.31 C27.+ | 176.53,67.31 175.26,66.04 175.26,43.18 176.53,41.91 IC20.9 | 31.75,41.91 IC5.9 35.56,41.91 C21.+ | 31.75,67.31 IC4.9 36.83,67.31 C20.+ | 128.27,67.31 IC15.9 132.08,67.31 C26.+ | 128.27,67.31 127,68.58 127,87.63 | 127,87.63 128.27,88.9 173.99,88.9 175.26,87.63 175.26,68.58 176.53,67.31 | 80.01,41.91 IC11.9 83.82,41.91 86.36,39.37 C23.+ | 80.01,41.91 78.74,43.18 78.74,66.04 80.01,67.31 | 80.01,67.31 78.74,68.58 78.74,87.63 | 78.74,87.63 80.01,88.9 125.73,88.9 127,87.63 | IC6.9 31.75,16.51 30.48,17.78 30.48,40.64 31.75,41.91 | 31.75,41.91 30.48,43.18 30.48,66.04 31.75,67.31 | 31.75,67.31 30.48,68.58 30.48,87.63 31.75,88.9 77.47,88.9 78.74,87.63 | IC12.9 80.01,16.51 78.74,17.78 78.74,40.64 80.01,41.91
  Bottom 1.93: IC23.1 182.88,27.94 184.15,29.21 184.15,30.48 | 184.15,30.48 C16.+ | 184.15,30.48 187.32,33.66 B1.+ 193.04,34.29 185.42,41.91 IC20.9
GND  (via drill 0.6, 0.8 pad 1.02)
  Top 1.016: IC19.8 171.45,67.31 176.53,62.23 186.69,62.23 187.96,63.5 | C16.- 186.69,39.37 193.04,39.37 X20.4 | IC21.22 134.62,35.56 137.16,38.1 143.51,38.1 X16.4 | IC4.8 26.67,67.31 30.48,63.5 C20.- 41.91,63.5 44.45,66.04 X2.4 | C21.- 41.91,40.64 X4.4 | 187.96,63.5 190.5,66.04 X18.4 | 187.96,63.5 C27.-
  Bottom 1.016: IC12.8 74.93,16.51 76.2,17.78 76.2,40.64 74.93,41.91 | 74.93,41.91 IC11.8 | 74.93,41.91 76.2,43.18 76.2,66.04 74.93,67.31 IC10.8 | C5.2 69.85,43.18 71.12,41.91 IC11.8 | C4.2 69.85,69.85 72.39,67.31 IC10.8 | C6.2 69.85,17.78 71.12,16.51 IC12.8 | IC19.8 171.45,67.31 172.72,66.04 172.72,43.18 171.45,41.91 IC20.8 167.64,41.91 166.37,43.18 C10.2 | IC16.8 119.38,41.91 118.11,43.18 C8.2 118.11,58.42 119.38,59.69 C24.- 120.65,63.5 121.92,64.77 IC15.8 119.38,67.31 118.11,68.58 C7.2 118.11,82.55 116.84,83.82 109.22,83.82 107.95,82.55 107.95,66.04 106.68,64.77 IC13.7 102.87,64.77 | 26.67,41.91 27.94,40.64 27.94,17.78 26.67,16.51 IC6.8 22.86,16.51 21.59,17.78 C3.2 | C9.2 166.37,69.85 168.91,67.31 IC19.8 | 26.67,41.91 IC5.8 | 26.67,41.91 27.94,43.18 27.94,66.04 26.67,67.31 | IC5.8 22.86,41.91 21.59,43.18 C2.2 | X4.4 50.8,40.64 53.34,38.1 | IC21.8 137.16,26.67 134.62,29.21 | 134.62,29.21 IC21.22 | 134.62,29.21 153.67,29.21 156.21,31.75 156.21,34.29 158.75,36.83 162.56,36.83 163.83,35.56 C15.2 | 101.6,40.64 102.87,39.37 IC14.7 105.41,34.29 106.68,33.02 108.94,33.02 S1.3 S1.4 109.5,27.66 109.22,27.94 104.14,27.94 101.6,25.4 101.6,16.51 100.33,15.24 X12.4 93.98,15.24 92.71,13.97 C28.- 76.2,13.97 IC12.8 | 101.6,40.64 X10.4 95.25,40.64 93.98,39.37 C23.- | IC18.7 148.59,39.37 147.32,40.64 148.59,40.64 149.86,41.91 149.86,60.96 IC17.7 | 102.87,64.77 101.6,66.04 X8.4 v93.98,66.04 92.71,64.77 C22.- | 102.87,64.77 102.87,41.91 101.6,40.64 | X14.4 138.43,66.04 C26.- 137.16,41.91 138.43,40.64 X16.4 | IC7.7 55.88,64.77 54.61,66.04 X2.4 | C1.2 21.59,68.58 22.86,67.31 IC4.8 | 26.67,67.31 27.94,68.58 27.94,86.36 26.67,87.63 7.62,87.63 6.35,86.36 6.35,66.04 7.62,64.77 IC1.7
  Bottom 1.016: IC3.7 11.43,13.97 15.24,10.16 48.26,10.16 49.53,8.89 57.15,8.89 59.69,6.35 102.87,6.35 107.95,11.43 127,11.43 128.27,12.7 | 26.67,67.31 IC4.8 | C17.- 24.13,38.1 25.4,39.37 IC5.8 | C13.- 24.13,63.5 25.4,64.77 IC4.8 | C18.- 72.39,63.5 73.66,64.77 IC10.8 | C19.- 72.39,38.1 73.66,39.37 IC11.8 | C25.- 168.91,63.5 170.18,64.77 IC19.8 | 128.27,12.7 SV1.7 SV1.8 | 128.27,12.7 129.54,11.43 156.21,11.43 165.1,20.32 165.1,22.86
  Bottom 1.27: IC21.8 C11.2 137.16,17.78 138.43,16.51 JP1.6 | X16.4 147.32,40.64 | IC18.7 149.86,39.37 | X6.4 52.07,15.24 | 52.07,15.24 53.34,13.97 IC9.7 59.69,13.97 62.23,11.43 72.39,11.43 73.66,12.7 IC12.8 | 7.62,39.37 IC2.7 | 7.62,39.37 6.35,38.1 6.35,15.24 7.62,13.97 IC3.7 | IC8.7 54.61,39.37 53.34,38.1 53.34,16.51 52.07,15.24 | IC1.7 6.35,62.23 6.35,40.64 7.62,39.37
  Bottom 1.778: 177.8,35.56 C14.2 | 177.8,35.56 179.07,36.83 C16.- | 170.18,39.37 173.99,39.37 177.8,35.56 | IC22.2 163.83,24.13 165.1,22.86 176.53,22.86 177.8,24.13
  Bottom 1.93: IC22.2 C15.2 | C14.2 IC23.2 177.8,24.13 179.07,22.86 192.41,22.86 B1.- | C12.- 170.18,39.37 IC20.8
  other vias: 40.64,69.85 40.64,72.39
  pour Bottom: 3.81,91.44 200.66,91.44 200.66,3.81 3.81,3.81
N$1
  Top 0.406: IC1.3 7.62,74.93 6.35,76.2 6.35,83.82 7.62,85.09 IC4.1
N$2
  Top 0.406: IC4.2 24.13,82.55 22.86,83.82 15.24,83.82 11.43,80.01 11.43,73.66 10.16,72.39 IC1.4
N$3
  Top 0.406: IC1.5 11.43,69.85 12.7,71.12 12.7,80.01 15.24,82.55 21.59,82.55 24.13,80.01 IC4.3
N$4
  Top 0.406: IC4.4 24.13,77.47 20.32,81.28 15.24,81.28 13.97,80.01 13.97,68.58 12.7,67.31 IC1.6
N$5
  Top 0.406: IC4.7 24.13,69.85 22.86,71.12 20.32,71.12 19.05,69.85 IC1.10
N$6
  Top 0.406: IC1.11 IC4.6
N$7
  Top 0.406: IC1.12 19.05,74.93 20.32,73.66 22.86,73.66 24.13,74.93 IC4.5
N$8
  Top 0.406: IC2.3 7.62,49.53 6.35,50.8 6.35,58.42 7.62,59.69 IC5.1
N$9
  Top 0.406: IC5.2 24.13,57.15 22.86,58.42 15.24,58.42 11.43,54.61 11.43,48.26 10.16,46.99 IC2.4
N$10
  Top 0.406: IC5.3 24.13,54.61 21.59,57.15 15.24,57.15 12.7,54.61 12.7,45.72 11.43,44.45 IC2.5
N$11
  Top 0.406: IC2.6 12.7,41.91 13.97,43.18 13.97,54.61 15.24,55.88 20.32,55.88 24.13,52.07 IC5.4
N$12
  Top 0.406: IC5.7 24.13,44.45 22.86,45.72 20.32,45.72 19.05,44.45 IC2.10
N$13
  Top 0.406: IC5.5 24.13,49.53 22.86,48.26 20.32,48.26 19.05,49.53 IC2.12
N$14
  Top 0.406: IC2.11 IC5.6
N$15
  Top 0.406: IC6.1 7.62,34.29 6.35,33.02 6.35,25.4 7.62,24.13 IC3.3
N$16
  Top 0.406: IC6.2 24.13,31.75 22.86,33.02 15.24,33.02 11.43,29.21 11.43,22.86 10.16,21.59 IC3.4
N$17
  Bottom 1.27: IC4.16 R1.1
N$18
  Bottom 1.27: IC4.15 R2.1
N$19
  Bottom 1.27: IC4.14 R3.1
N$20
  Bottom 1.27: IC4.13 R4.1
N$21
  Bottom 1.27: IC4.12 R5.1
N$22
  Bottom 1.27: IC4.11 R6.1
N$23
  Bottom 1.27: IC4.10 R7.1
N$24
  Bottom 1.016: R1.2 45.72,86.36 X1.1
N$25
  Bottom 1.016: R2.2 45.72,82.55 46.99,83.82 X1.2
N$26
  Bottom 1.016: R3.2 46.99,80.01 48.26,81.28 X1.3
N$27
  Bottom 1.016: R4.2 48.26,77.47 X1.4
N$28
  Bottom 1.016: R5.2 48.26,74.93 X2.1
N$29
  Bottom 1.016: R6.2 46.99,72.39 48.26,71.12 X2.2
N$30
  Bottom 1.016: R7.2 45.72,69.85 46.99,68.58 X2.3
N$31
  Bottom 1.27: IC5.16 R8.1
N$32
  Bottom 1.27: IC5.15 R9.1
N$33
  Bottom 1.27: IC5.14 R10.1
N$34
  Bottom 1.27: IC5.13 R11.1
N$35
  Bottom 1.27: IC5.12 R12.1
N$36
  Bottom 1.27: IC5.11 R13.1
N$37
  Bottom 1.27: IC5.10 R14.1
N$38
  Bottom 1.016: R8.2 45.72,60.96 X3.1
N$39
  Bottom 1.016: R9.2 45.72,57.15 46.99,58.42 X3.2
N$40
  Bottom 1.016: R10.2 46.99,54.61 48.26,55.88 X3.3
N$41
  Bottom 1.016: R11.2 48.26,52.07 X3.4
N$42
  Bottom 1.016: R12.2 48.26,49.53 X4.1
N$43
  Bottom 1.016: R13.2 46.99,46.99 48.26,45.72 X4.2
N$44
  Bottom 1.016: R14.2 45.72,44.45 46.99,43.18 X4.3
N$45
  Bottom 1.27: IC6.16 R15.1
N$46
  Bottom 1.27: IC6.15 R16.1
N$47
  Bottom 1.27: IC6.14 R17.1
N$48
  Bottom 1.27: IC6.13 R18.1
N$49
  Bottom 1.27: IC6.12 R19.1
N$50
  Bottom 1.27: IC6.11 R20.1
N$51
  Bottom 1.27: IC6.10 R21.1
N$52
  Bottom 1.016: R15.2 45.72,35.56 X5.1
N$53
  Bottom 1.016: R16.2 45.72,31.75 46.99,33.02 X5.2
N$54
  Bottom 1.016: R17.2 46.99,29.21 48.26,30.48 X5.3
N$55
  Bottom 1.016: R18.2 48.26,26.67 X5.4
N$56
  Bottom 1.016: R19.2 48.26,24.13 X6.1
N$57
  Bottom 1.016: R20.2 46.99,21.59 48.26,20.32 X6.2
N$58
  Bottom 1.016: R21.2 45.72,19.05 46.99,17.78 X6.3
N$59
  Top 0.406: SV1.1 SV1.2 120.65,20.32 121.92,21.59 IC21.2
N$60
  Top 0.406: SV1.3 SV1.4 123.19,20.32 124.46,21.59 IC21.3
N$61
  Top 0.406: IC3.5 11.43,19.05 12.7,20.32 12.7,29.21 15.24,31.75 21.59,31.75 24.13,29.21 IC6.3
N$62
  Top 0.406: IC6.4 24.13,26.67 20.32,30.48 15.24,30.48 13.97,29.21 13.97,17.78 12.7,16.51 IC3.6
N$63
  Top 0.406: IC6.7 24.13,19.05 22.86,20.32 20.32,20.32 19.05,19.05 IC3.10
N$64
  Top 0.406: IC6.5 24.13,24.13 22.86,22.86 20.32,22.86 19.05,24.13 IC3.12
N$65
  Top 0.406: IC3.11 IC6.6
N$66
  Bottom 1.016: IC10.16 R22.1
N$67
  Bottom 0.406: IC3.2 IC3.1 8.89,30.48 13.97,35.56 13.97,50.8 15.24,52.07 IC2.13
N$68
  Bottom 0.406: IC2.2 IC2.1 8.89,57.15 13.97,62.23 13.97,76.2 15.24,77.47 IC1.13
N$69
  Bottom 1.016: IC10.15 R23.1
N$70
  Bottom 1.016: IC10.14 R24.1
N$71
  Bottom 1.016: IC10.13 R25.1
N$72
  Bottom 1.016: IC10.12 R26.1
N$73
  Bottom 1.016: IC10.11 R27.1
N$74
  Bottom 1.016: IC10.10 R28.1
N$75
  Bottom 1.016: R22.2 93.98,86.36 X7.1
N$76
  Bottom 1.016: R23.2 93.98,82.55 95.25,83.82 X7.2
N$77
  Bottom 1.016: R24.2 95.25,80.01 96.52,81.28 X7.3
N$78
  Bottom 1.016: R25.2 96.52,77.47 X7.4
N$79
  Bottom 1.016: R26.2 96.52,74.93 X8.1
N$80
  Bottom 1.016: R27.2 93.98,72.39 95.25,71.12 X8.2
N$81
  Bottom 1.016: R28.2 93.98,68.58 X8.3
N$82
  Bottom 1.016: IC11.16 R29.1
N$83
  Bottom 1.016: IC11.15 R30.1
N$84
  Bottom 1.016: IC11.14 R31.1
N$85
  Bottom 1.016: IC11.13 R32.1
N$86
  Bottom 1.016: IC11.12 R33.1
N$87
  Bottom 1.016: IC11.11 R34.1
N$88
  Bottom 1.016: IC11.10 R35.1
N$89
  Bottom 1.016: R29.2 93.98,60.96 X9.1
N$90
  Bottom 1.016: R30.2 93.98,57.15 95.25,58.42 X9.2
N$91
  Bottom 1.016: R31.2 95.25,54.61 96.52,55.88 X9.3
N$92
  Bottom 1.016: R32.2 96.52,52.07 X9.4
N$93
  Bottom 1.016: R33.2 96.52,49.53 X10.1
N$94
  Bottom 1.016: R34.2 95.25,46.99 96.52,45.72 X10.2
N$95
  Bottom 1.016: R35.2 93.98,44.45 95.25,43.18 X10.3
N$96
  Bottom 1.016: IC12.16 R36.1
N$97
  Bottom 1.016: IC12.15 R37.1
N$98
  Bottom 1.016: IC12.14 R38.1
N$99
  Bottom 1.016: IC12.13 R39.1
N$100
  Bottom 1.016: IC12.12 R40.1
N$101
  Bottom 1.016: IC12.11 R41.1
N$102
  Bottom 1.016: IC12.10 R42.1
N$103
  Bottom 1.016: R36.2 93.98,35.56 X11.1
N$104
  Bottom 1.016: R37.2 93.98,31.75 95.25,33.02 X11.2
N$105
  Bottom 1.016: R38.2 95.25,29.21 96.52,30.48 X11.3
N$106
  Bottom 1.016: R39.2 96.52,26.67 X11.4
N$107
  Bottom 1.016: R40.2 96.52,24.13 X12.1
N$108
  Bottom 1.016: R41.2 95.25,21.59 96.52,20.32 X12.2
N$109
  Bottom 1.016: R42.2 93.98,19.05 95.25,17.78 X12.3
N$110
  Bottom 0.406: IC9.2 IC9.1 57.15,31.75 62.23,36.83 62.23,50.8 63.5,52.07 IC8.13
N$111
  Bottom 0.406: IC8.2 IC8.1 57.15,57.15 62.23,62.23 62.23,76.2 63.5,77.47 IC7.13
N$112
  Bottom 1.016: IC15.16 R43.1
N$113
  Top 0.406: SV1.5 SV1.6 125.73,20.32 127,21.59 130.81,21.59 132.08,22.86 IC21.6
N$114
  Top 0.406: IC7.6 60.96,67.31 62.23,68.58 62.23,80.01 63.5,81.28 68.58,81.28 72.39,77.47 IC10.4
N$115
  Top 0.406: IC7.5 59.69,69.85 60.96,71.12 60.96,81.28 62.23,82.55 69.85,82.55 72.39,80.01 IC10.3
N$116
  Top 0.406: IC7.4 58.42,72.39 59.69,73.66 59.69,82.55 60.96,83.82 71.12,83.82 72.39,82.55 IC10.2
N$117
  Top 0.406: IC7.3 55.88,74.93 54.61,76.2 54.61,81.28 55.88,82.55 58.42,82.55 60.96,85.09 IC10.1
N$118
  Top 0.406: IC7.10 66.04,69.85 67.31,71.12 71.12,71.12 72.39,69.85 IC10.7
N$119
  Top 0.406: IC7.11 IC10.6
N$120
  Top 0.406: IC7.12 66.04,74.93 67.31,73.66 71.12,73.66 72.39,74.93 IC10.5
N$121
  Top 0.406: IC11.1 55.88,59.69 54.61,58.42 54.61,50.8 55.88,49.53 IC8.3
N$122
  Top 0.406: IC8.4 58.42,46.99 59.69,48.26 59.69,54.61 63.5,58.42 71.12,58.42 72.39,57.15 IC11.2
N$123
  Top 0.406: IC8.5 59.69,44.45 60.96,45.72 60.96,54.61 63.5,57.15 69.85,57.15 72.39,54.61 IC11.3
N$124
  Top 0.406: IC8.6 60.96,41.91 62.23,43.18 62.23,54.61 63.5,55.88 68.58,55.88 72.39,52.07 IC11.4
N$125
  Top 0.406: IC11.7 72.39,44.45 71.12,45.72 67.31,45.72 66.04,44.45 IC8.10
N$126
  Top 0.406: IC8.12 66.04,49.53 67.31,48.26 71.12,48.26 72.39,49.53 IC11.5
N$127
  Top 0.406: IC8.11 IC11.6
N$128
  Top 0.406: IC9.3 55.88,24.13 54.61,25.4 54.61,33.02 55.88,34.29 IC12.1
N$129
  Top 0.406: IC9.4 58.42,21.59 59.69,22.86 59.69,29.21 63.5,33.02 71.12,33.02 72.39,31.75 IC12.2
N$130
  Top 0.406: IC9.5 59.69,19.05 60.96,20.32 60.96,29.21 63.5,31.75 69.85,31.75 72.39,29.21 IC12.3
N$131
  Top 0.406: IC9.6 60.96,16.51 62.23,17.78 62.23,29.21 63.5,30.48 68.58,30.48 72.39,26.67 IC12.4
N$132
  Top 0.406: IC9.10 66.04,19.05 67.31,20.32 71.12,20.32 72.39,19.05 IC12.7
N$133
  Top 0.406: IC9.12 66.04,24.13 67.31,22.86 72.39,22.86 IC12.5
N$134
  Top 0.406: IC9.11 IC12.6
N$135
  Bottom 1.016: IC15.15 R44.1
N$136
  Bottom 1.016: IC15.14 R45.1
N$137
  Bottom 1.016: IC15.13 R46.1
N$138
  Bottom 1.016: IC15.12 R47.1
N$139
  Bottom 1.016: IC15.11 R48.1
N$140
  Bottom 1.016: IC15.10 R49.1
N$141
  Bottom 1.016: R43.2 142.24,86.36 X13.1
N$142
  Bottom 1.016: R44.2 142.24,82.55 143.51,83.82 X13.2
N$143
  Bottom 1.016: R45.2 143.51,80.01 144.78,81.28 X13.3
N$144
  Bottom 1.016: R46.2 144.78,77.47 X13.4
N$145
  Bottom 1.016: R47.2 144.78,74.93 X14.1
N$146
  Bottom 1.016: R48.2 143.51,72.39 144.78,71.12 X14.2
N$147
  Bottom 1.016: R49.2 142.24,69.85 143.51,68.58 X14.3
N$148
  Bottom 1.016: IC16.16 R50.1
N$149
  Bottom 1.016: IC16.15 R51.1
N$150
  Bottom 1.016: IC16.14 R52.1
N$151
  Bottom 1.016: IC16.13 R53.1
N$152
  Bottom 1.016: IC16.12 R54.1
N$153
  Bottom 1.016: IC16.11 R55.1
N$154
  Bottom 1.016: IC16.10 R56.1
N$155
  Bottom 1.016: R50.2 142.24,60.96 X15.1
N$156
  Bottom 1.016: R51.2 142.24,57.15 143.51,58.42 X15.2
N$157
  Bottom 1.016: R52.2 143.51,54.61 144.78,55.88 X15.3
N$158
  Bottom 1.016: R53.2 144.78,52.07 X15.4
N$159
  Bottom 1.016: R54.2 144.78,49.53 X16.1
N$160
  Bottom 1.016: R55.2 143.51,46.99 144.78,45.72 X16.2
N$161
  Bottom 1.016: R56.2 142.24,44.45 143.51,43.18 X16.3
N$162
  Bottom 0.406: IC14.2 IC14.1 105.41,57.15 110.49,62.23 110.49,76.2 111.76,77.47 IC13.13
N$164
  Bottom 0.406: 1.27,93.98 203.2,93.98 203.2,1.27 1.27,1.27 1.27,93.98
N$165
  Top 0.406: IC15.7 120.65,69.85 119.38,71.12 115.57,71.12 114.3,69.85 IC13.10
N$166
  Top 0.406: IC15.5 120.65,74.93 119.38,73.66 115.57,73.66 114.3,74.93 IC13.12
N$167
  Top 0.406: IC13.11 IC15.6
N$168
  Top 0.406: IC14.10 114.3,44.45 115.57,45.72 119.38,45.72 120.65,44.45 IC16.7
N$169
  Top 0.406: IC16.5 120.65,49.53 119.38,48.26 115.57,48.26 114.3,49.53 IC14.12
N$170
  Top 0.406: IC14.11 IC16.6
N$171
  Top 0.406: IC15.1 104.14,85.09 102.87,83.82 102.87,76.2 104.14,74.93 IC13.3
N$172
  Top 0.406: IC13.4 106.68,72.39 107.95,73.66 107.95,80.01 111.76,83.82 119.38,83.82 120.65,82.55 IC15.2
N$173
  Top 0.406: IC13.5 107.95,69.85 109.22,71.12 109.22,80.01 111.76,82.55 118.11,82.55 120.65,80.01 IC15.3
N$174
  Top 0.406: IC13.6 109.22,67.31 110.49,68.58 110.49,80.01 111.76,81.28 116.84,81.28 120.65,77.47 IC15.4
N$175
  Top 0.406: IC16.1 104.14,59.69 102.87,58.42 102.87,50.8 104.14,49.53 IC14.3
N$176
  Top 0.406: IC14.4 106.68,46.99 107.95,48.26 107.95,54.61 111.76,58.42 119.38,58.42 120.65,57.15 IC16.2
N$177
  Top 0.406: IC14.5 107.95,44.45 109.22,45.72 109.22,54.61 111.76,57.15 118.11,57.15 120.65,54.61 IC16.3
N$178
  Top 0.406: IC16.4 120.65,52.07 116.84,55.88 111.76,55.88 110.49,54.61 110.49,43.18 109.22,41.91 IC14.6
N$179
  Bottom 1.016: IC19.16 R57.1
N$180
  Bottom 1.016: IC19.15 R58.1
N$181
  Bottom 1.016: IC19.14 R59.1
N$182
  Bottom 1.016: IC19.13 R60.1
N$183
  Bottom 1.016: IC19.12 R61.1
N$184
  Bottom 1.016: IC19.11 R62.1
N$185
  Bottom 1.016: IC19.10 R63.1
N$186
  Bottom 1.016: R57.2 190.5,86.36 X17.1
N$187
  Bottom 1.016: R58.2 190.5,82.55 191.77,83.82 X17.2
N$188
  Bottom 1.016: R59.2 191.77,80.01 193.04,81.28 X17.3
N$189
  Bottom 1.016: R60.2 193.04,77.47 X17.4
N$190
  Bottom 1.016: R61.2 193.04,74.93 X18.1
N$191
  Bottom 1.016: R62.2 191.77,72.39 193.04,71.12 X18.2
N$192
  Bottom 1.016: R63.2 190.5,69.85 191.77,68.58 X18.3
N$193
  Bottom 1.016: IC20.16 R64.1
N$194
  Bottom 1.016: IC20.15 R65.1
N$195
  Bottom 1.016: IC20.14 R66.1
N$196
  Bottom 1.016: IC20.13 R67.1
N$197
  Bottom 1.016: IC20.12 R68.1
N$198
  Bottom 1.016: IC20.11 R69.1
N$199
  Bottom 1.016: IC20.10 R70.1
N$200
  Bottom 1.016: R64.2 190.5,60.96 X19.1
N$201
  Bottom 1.016: R65.2 190.5,57.15 191.77,58.42 X19.2
N$202
  Bottom 1.016: R66.2 191.77,54.61 193.04,55.88 X19.3
N$203
  Bottom 1.016: R67.2 193.04,52.07 X19.4
N$204
  Bottom 1.016: R68.2 193.04,49.53 X20.1
N$205
  Bottom 1.016: R69.2 191.77,46.99 193.04,45.72 X20.2
N$206
  Bottom 1.016: R70.2 190.5,44.45 191.77,43.18 X20.3
N$207
  Bottom 0.406: IC18.2 IC18.1 153.67,57.15 158.75,62.23 158.75,76.2 160.02,77.47 IC17.13
N$208  (via drill 0.6, 0.8 pad 1.02)
  Top 0.406: v146.05,63.5 138.43,63.5 137.16,62.23 137.16,40.64 135.89,39.37 v133.35,39.37
  Bottom 0.406: IC17.1 IC17.2 152.4,77.47 151.13,76.2 151.13,66.04 148.59,63.5 v146.05,63.5 | IC14.13 110.49,52.07 109.22,50.8 109.22,38.1 110.49,36.83 114.3,36.83 116.84,39.37 v133.35,39.37
N$209
  Top 0.406: IC21.18 144.78,30.48 146.05,29.21 153.67,29.21 156.21,26.67 156.21,22.86 153.67,20.32 JP1.1
N$210
  Top 0.406: IC19.7 168.91,69.85 167.64,71.12 163.83,71.12 162.56,69.85 IC17.10
N$211
  Top 0.406: IC19.5 168.91,74.93 167.64,73.66 163.83,73.66 162.56,74.93 IC17.12
N$212
  Top 0.406: IC17.11 IC19.6
N$213
  Top 0.406: IC20.7 168.91,44.45 167.64,45.72 163.83,45.72 162.56,44.45 IC18.10
N$214
  Top 0.406: IC20.5 168.91,49.53 167.64,48.26 163.83,48.26 162.56,49.53 IC18.12
N$215
  Top 0.406: IC18.11 IC20.6
N$216
  Top 0.406: IC19.1 152.4,85.09 151.13,83.82 151.13,76.2 152.4,74.93 IC17.3
N$217
  Top 0.406: IC17.4 154.94,72.39 156.21,73.66 156.21,80.01 160.02,83.82 167.64,83.82 168.91,82.55 IC19.2
N$218
  Top 0.406: IC17.5 156.21,69.85 157.48,71.12 157.48,80.01 160.02,82.55 166.37,82.55 168.91,80.01 IC19.3
N$219
  Top 0.406: IC19.4 168.91,77.47 165.1,81.28 160.02,81.28 158.75,80.01 158.75,68.58 157.48,67.31 IC17.6
N$220
  Top 0.406: IC20.1 152.4,59.69 151.13,58.42 151.13,50.8 152.4,49.53 IC18.3
N$221
  Top 0.406: IC18.4 154.94,46.99 156.21,48.26 156.21,54.61 160.02,58.42 167.64,58.42 168.91,57.15 IC20.2
N$222
  Top 0.406: IC18.5 156.21,44.45 157.48,45.72 157.48,54.61 160.02,57.15 166.37,57.15 168.91,54.61 IC20.3
N$223
  Top 0.406: IC20.4 168.91,52.07 165.1,55.88 160.02,55.88 158.75,54.61 158.75,43.18 157.48,41.91 IC18.6
N$224
  Top 0.406: IC21.17 147.32,31.75 148.59,30.48 153.67,30.48 157.48,26.67 157.48,15.24 156.21,13.97 152.4,13.97 151.13,15.24 JP1.4
N$225
  Top 0.406: IC21.19 142.24,29.21 143.51,27.94 153.67,27.94 154.94,26.67 154.94,22.86 153.67,21.59 152.4,21.59 151.13,20.32 JP1.3
N$226  (1 unrouted)
  Top 0.406: JP1.5 135.89,19.05 133.35,16.51 133.35,8.89 132.08,7.62 105.41,7.62 104.14,8.89 104.14,20.32 105.41,21.59 | R71.1 105.41,30.48 102.87,27.94 102.87,24.13 105.41,21.59 | 105.41,21.59 111.76,21.59 114.3,24.13 | 114.3,24.13 114.3,25.68 S1.2 | IC21.1 119.38,24.13 118.11,22.86 115.57,22.86 114.3,24.13
N$227
  Bottom 1.27: IC22.1 170.18,27.94 IC23.3
  Bottom 1.93: IC23.3 C14.1 | 170.18,27.94 C12.+
N$228
  Bottom 2.54: J1.3 195.58,11.43 198.12,13.97 198.12,27.94 196.85,29.21 193.67,29.21 B1.AC2
N$229
  Top 2.54: J1.1 187.96,11.43 186.69,12.7 186.69,17.78 187.96,19.05 196.85,19.05 198.12,20.32 198.12,24.13 196.85,25.4 193.67,25.4 B1.AC1
PORTC0  (via drill 0.6)
  Top 0.406: IC21.23 132.08,36.83 130.81,38.1 127,38.1 125.73,39.37 125.73,86.36 124.46,87.63 106.68,87.63 v105.41,86.36
  Bottom 0.406: IC13.2 IC13.1 v105.41,86.36
PORTC1
  Top 0.406: IC17.8 161.29,63.5 160.02,62.23 151.13,62.23 | 151.13,62.23 149.86,63.5 149.86,87.63 148.59,88.9 102.87,88.9 101.6,87.63 101.6,64.77 104.14,62.23 111.76,62.23 113.03,63.5 | IC18.8 161.29,38.1 160.02,36.83 151.13,36.83 149.86,38.1 149.86,60.96 151.13,62.23 | IC21.24 129.54,34.29 124.46,39.37 IC14.8 123.19,39.37 124.46,40.64 124.46,60.96 123.19,62.23 120.65,62.23 119.38,60.96 115.57,60.96 113.03,63.5 | 113.03,63.5 IC13.8
PORTC2  (via drill 0.6)
  Top 0.406: IC21.25 127,34.29 123.19,38.1 115.57,38.1 114.3,36.83 102.87,36.83 101.6,38.1 95.25,38.1 93.98,36.83 80.01,36.83 77.47,39.37 77.47,86.36 76.2,87.63 72.39,87.63 71.12,86.36 59.69,86.36 v57.15,83.82
  Bottom 0.406: IC7.2 IC7.1 v57.15,83.82
PORTC3  (via drill 0.8 pad 0.41)
  Top 0.406: IC21.26 124.46,34.29 121.92,36.83 118.11,36.83 116.84,35.56 105.41,35.56 101.6,31.75 101.6,11.43 100.33,10.16 91.44,10.16 90.17,8.89 83.82,8.89 82.55,10.16 7.62,10.16 5.08,12.7 5.08,59.69 6.35,60.96 10.16,60.96 v11.43,62.23
  Bottom 0.406: IC1.1 IC1.2 10.16,77.47 11.43,76.2 v11.43,62.23
PORTC4  (via drill 0.6)
  Top 0.406: IC7.8 64.77,63.5 62.23,60.96 55.88,60.96 53.34,58.42 53.34,40.64 52.07,39.37 | IC8.8 64.77,38.1 63.5,36.83 54.61,36.83 | 54.61,36.83 52.07,39.37 | IC9.8 64.77,12.7 63.5,11.43 54.61,11.43 53.34,12.7 | 53.34,12.7 53.34,35.56 54.61,36.83 | IC3.8 17.78,13.97 19.05,12.7 53.34,12.7 | v11.43,36.83 15.24,36.83 16.51,38.1 IC2.8 17.78,39.37 19.05,40.64 22.86,40.64 24.13,39.37 29.21,39.37 31.75,36.83 43.18,36.83 44.45,38.1 50.8,38.1 52.07,39.37
  Bottom 0.406: IC1.8 16.51,62.23 11.43,57.15 v11.43,36.83

### Text on the board
Bottom: Taller de Electronica 2010 | Control Display - Parqueadero Santo Domingo